# EAGLE design Coco2Composite (EAGLE 9.6.2)
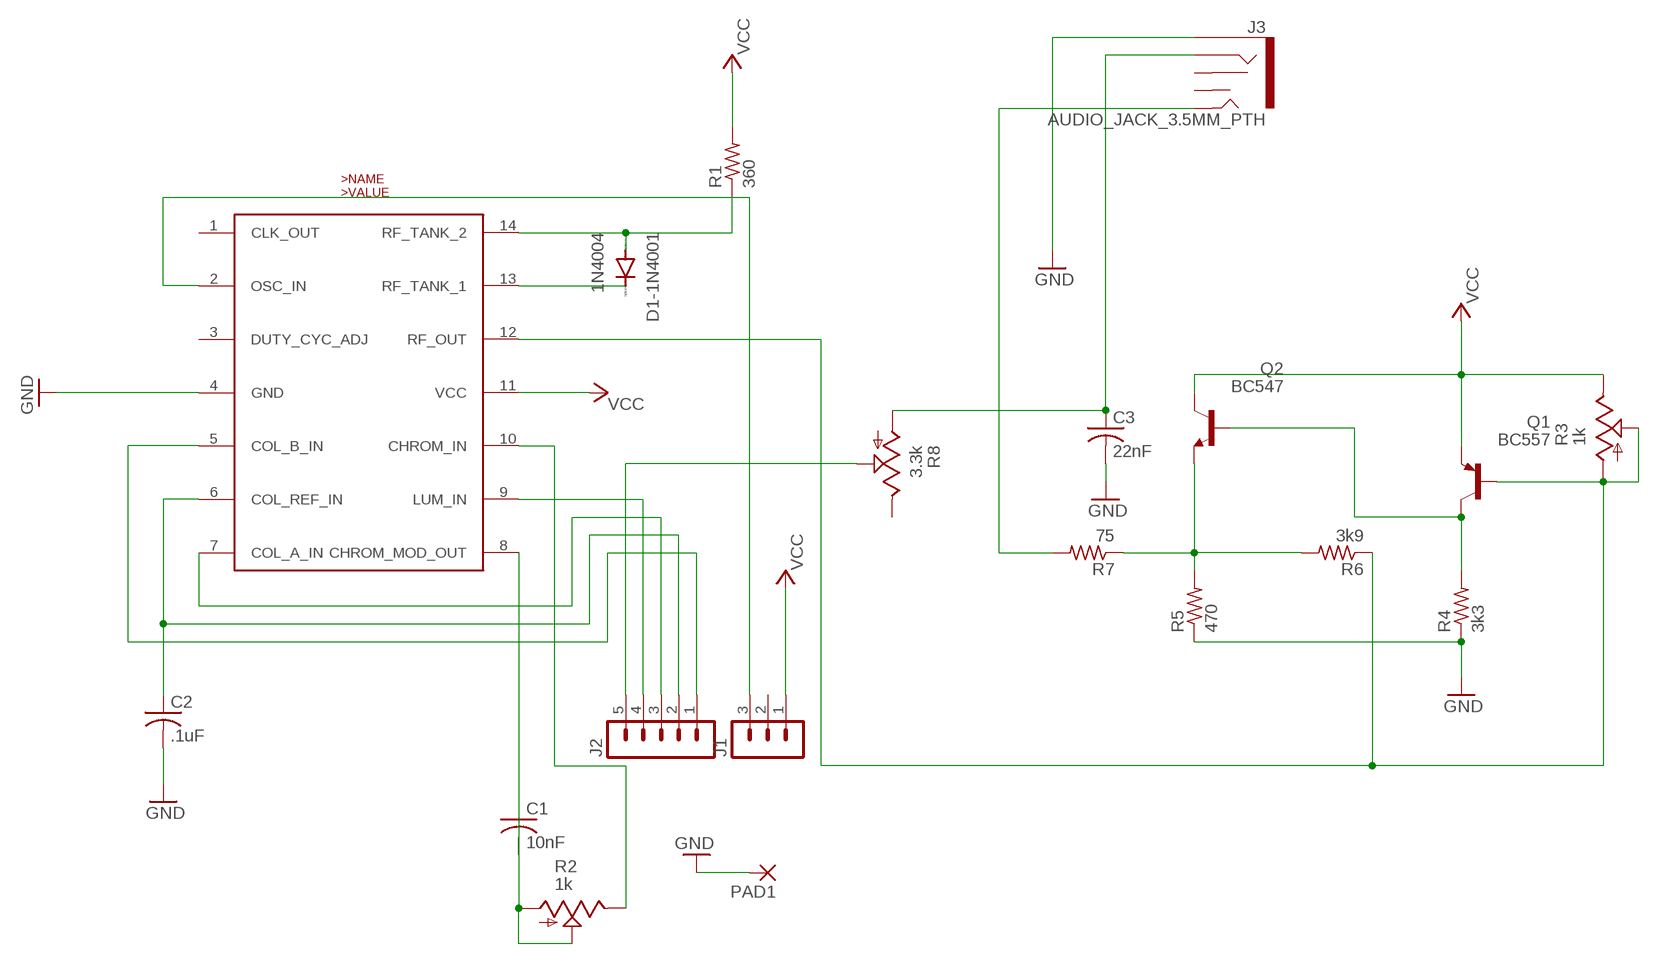
[diagram p0: schematic, sheet 1]

## Parts
C1  10nF  C-US025-024X044  [C025-024X044]
C2  .1uF  C-US025-024X044  [C025-024X044]
C3  22nF  C-US025-024X044  [C025-024X044]
D1-1N4001  1N4004  [DO41-10]
J1  MA03-1  [MA03-1]
J2  MA05-1  [MA05-1]
J3  AUDIO_JACK_3.5MM_PTH  [AUDIO-JACK]
PAD1  2,54/0,8  [2,54/0,8]
Q1  BC557  [TO92-EBC]
Q2  BC547  [TO92]
R1  360  R-US_0204/2V  [0204V]
R2  1k  TRIM_US-B25U  [B25U]
R3  1k  TRIM_US-B25U  [B25U]
R4  3k3  R-US_0204/2V  [0204V]
R5  470  R-US_0204/2V  [0204V]
R6  3k9  R-US_0204/2V  [0204V]
R7  75  R-US_0204/2V  [0204V]
R8  3.3k  TRIM_US-B25U  [B25U]
U1  MC1372  [DIP14]

## Nets
CHB: C2.1 J2.2 U1.6(COL_REF_IN)
CLK: J1.3 U1.2(OSC_IN)
GND: C2.2 C3.2 J3.SLEEVE PAD1.1(P) R4.1 R5.1 U1.4(GND)
N$1: D1-1N4001.C U1.13(RF_TANK_1)
N$2: D1-1N4001.A R1.1 U1.14(RF_TANK_2)
N$3: C1.2 U1.8(CHROM_MOD_OUT)
N$4: C1.1 R2.A R2.S
N$5: R2.E U1.10(CHROM_IN)
N$6: Q1.B R3.A R3.S R6.1 U1.12(RF_OUT)
N$7: Q1.C Q2.2(B) R4.2
N$8: Q2.1(E) R5.2 R6.2 R7.1
N$9: J3.TIP R7.2
N$10: C3.1 J3.RING R8.A
PHI_A: J2.3 U1.7(COL_A_IN)
PHIB: J2.1 U1.5(COL_B_IN)
SND: J2.5 R8.S
VCC: J1.1 Q1.E Q2.3(C) R1.2 R3.E U1.11(VCC)
Y: J2.4 U1.9(LUM_IN)
Unconnected: J1.2 J3.RSH J3.TSH R8.E U1.1(CLK_OUT) U1.3(DUTY_CYC_ADJ)

## Library data of the parts
C1-C3 = resistor:C-US: CAPACITOR, American symbol
D1-1N4001 = diode:1N4004: DIODE general purpose rectifier, 1 A
J1 = con-lstb:MA03-1: PIN HEADER; OC_FARNELL: unknown; OC_NEWARK: unknown
J2 = con-lstb:MA05-1: PIN HEADER; OC_FARNELL: unknown; OC_NEWARK: unknown
J3 = SparkFun-Connectors:AUDIO_JACK_3.5MM: Audio Jack 3.5mm variants of PTH and SMT stereo audio jack with bypass switches. SparkFun Products: SparkFun SparkPunk Sound Kit <[https://www.sparkfun.com/products/11177]> - PTH MP3 Trigger <https://www.sparkfun.com/products/13720> -3.5mm SMD SparkFun PicoBoard <https://www.sparkfun.com/products/11888>- 2.5mm SMD; PROD_ID: CONN-08774; SF_ID: PRT-08032
PAD1 = wirepad:2,54/0,8: THROUGH-HOLE PAD
Q1 = transistor-pnp:BC557*: PNP Transistror
Q2 = transistor-npn:BC547*: NPN Transistor
R1 R4-R7 = resistor:R-US_: RESISTOR, American symbol
R2 R3 R8 = pot:TRIM_US-: POTENTIOMETER
U1 = COCO2Library:MC1372: MC1372

## Board
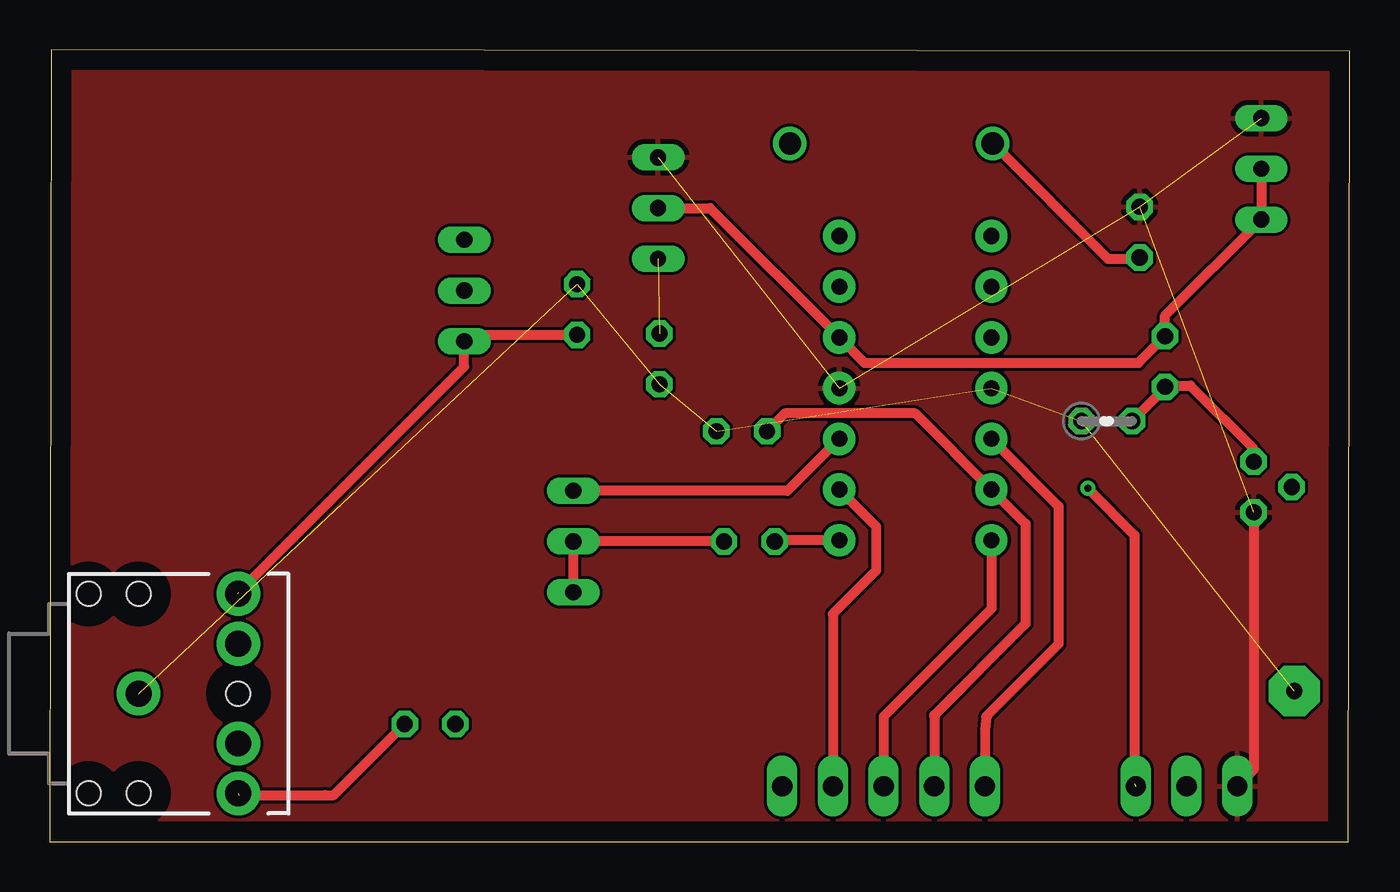
[diagram p1: board, top side]
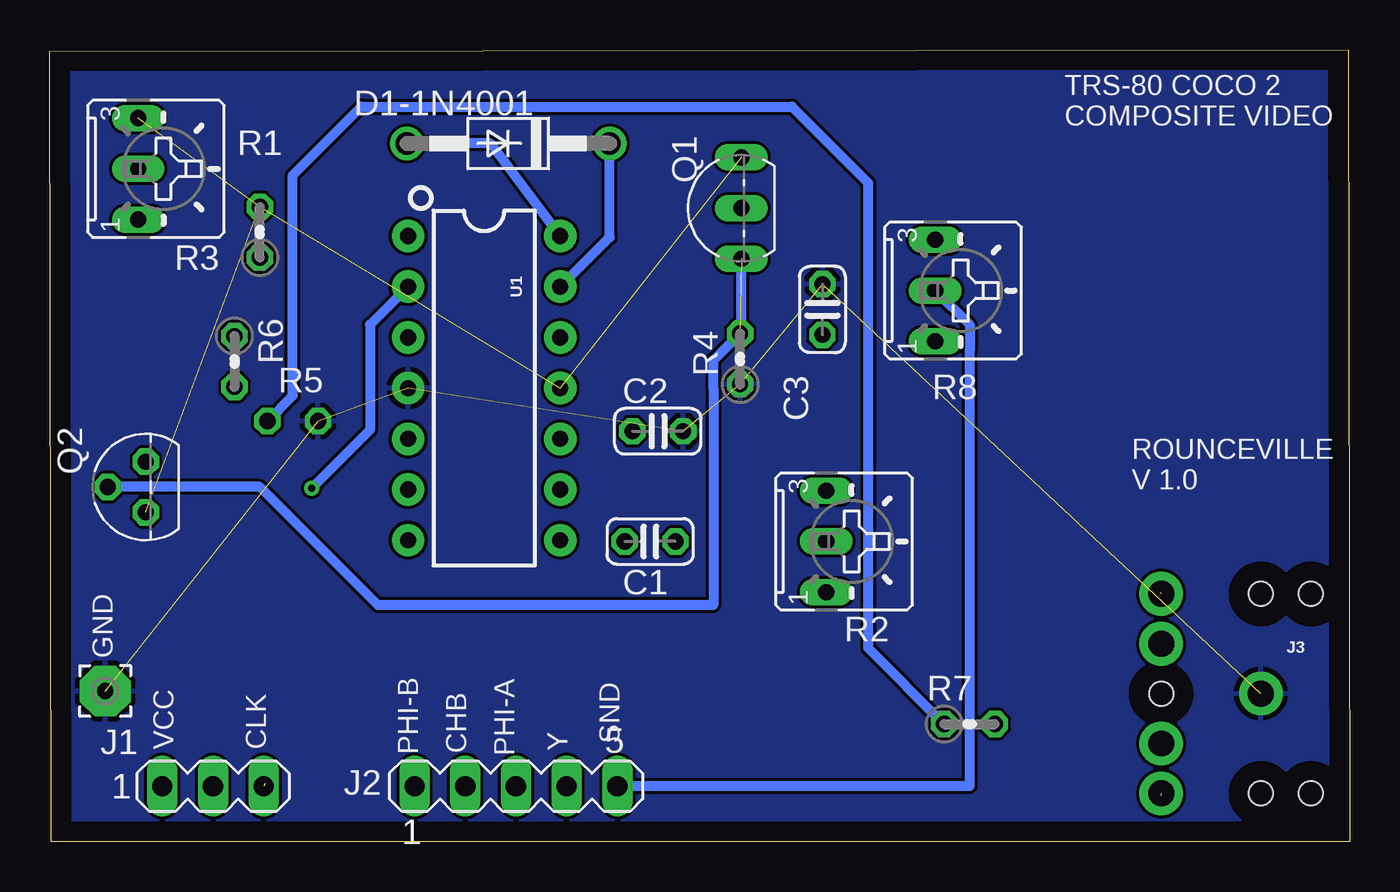
[diagram p2: board, bottom side, seen from below]

Size 65.13 x 39.67 mm. Coordinates in mm from the lower left corner, seen from the top.
Outline: 0,0 65.07,0 65.13,39.61 0.06,39.67 0,0
Copper layers (1*16): Top 0.035mm / dielectric 1.5mm / Bottom 0.035mm
Design rules "default": minimum track width 6mil, minimum drill 0.35mm, track to track 6mil, track to pad 6mil, pad to pad 6mil, via to via 6mil, smd to smd 6mil, copper to edge 40mil, drill to drill 6mil, minimum pad ring 10mil, minimum via ring 8mil, stop-mask expansion 4mil, vias tented up to drill 0mil, thermal gap 10mil

### Footprints (pad centres in the part's own frame; a part is rotated, then mirrored left to right if it is on the bottom)
C025-024X044 = drill 0.813 octagon: 1 -1.27,0; 2 1.27,0
DO41-10 = drill 1.118: A 5.08,0; C -5.08,0
MA03-1 = drill 1.016 long: 1 -2.54,0; 2 0,0; 3 2.54,0
MA05-1 = drill 1.016 long: 1 -5.08,0; 2 -2.54,0; 3 0,0; 4 2.54,0; 5 5.08,0
AUDIO-JACK = drill 1.3 pad 2.184: RING 5,5; RSH 5,2.5; SLEEVE 0,0; TIP 5,-5; TSH 5,-2.5 | hole 1.2: 0,5; -2.5,5; -2.5,-5; 0,-5; 5,0
2,54/0,8 = drill 0.813 pad 2.54 octagon: 1 0,0
TO92-EBC = drill 0.813 long: B 0,-1.27; C -2.54,-1.27; E 2.54,-1.27
TO92 = drill 0.813 octagon: 1 1.27,0; 2 0,1.905; 3 -1.27,0
0204V = drill 0.813 octagon: 1 -1.27,0; 2 1.27,0
B25U = drill 0.813 long: A 2.54,-0.889; E -2.54,-0.889; S 0,-0.889
DIP14 = drill 0.813 pad 1.626: 1 -7.62,-3.81; 2 -5.08,-3.81; 3 -2.54,-3.81; 4 0,-3.81; 5 2.54,-3.81; 6 5.08,-3.81; 7 7.62,-3.81; 8 7.62,3.81; 9 5.08,3.81; 10 2.54,3.81; 11 0,3.81; 12 -2.54,3.81; 13 -5.08,3.81; 14 -7.62,3.81

### Placement (x,y rotation side)
C1  35.05,15.05 180 bottom
C2  34.67,20.57 0 bottom
C3  26.42,26.67 90 bottom
D1-1N4001  42.16,34.99 180 bottom
J1  56.96,2.79 0 bottom
J2  41.78,2.79 0 bottom
J3  4.45,7.43 0 top
PAD1  62.36,7.56 0 bottom
Q1  31.75,31.75 90 bottom
Q2  60.33,17.78 90 bottom
R1  54.61,30.54 90 bottom
R2  25.34,15.05 270 bottom
R3  59.82,33.72 270 bottom
R4  30.54,24.19 90 bottom
R5  52.96,21.08 0 top
R6  55.88,24.07 270 bottom
R7  19.05,5.91 0 bottom
R8  19.88,27.62 270 bottom
U1  43.37,22.73 270 bottom

### Tracks (layer width: path | path; a pad name or v marks a point on that pad's centre or on a via)
CHB
  Top 0.503: C2.1 36.83,21.46 43.37,21.46 U1.6 48.9,15.94 48.9,10.92 44.32,6.35 44.32,6.3 J2.2
CLK  (via drill 0.35)  (1 unrouted)
  Top 0.503: v52.01,17.72 54.36,15.37 54.36,2.92
  Bottom 0.503: U1.2 49.09,25.91 49.09,20.64 v52.01,17.72
GND  (6 unrouted)
  pour Bottom: 0.06,0 67.31,0 67.31,41.91 0.06,41.91
N$1
  Bottom 0.508: U1.13 37.08,30.29 D1-1N4001.C
N$2
  Top 0.152: 54.55,29.21 R1.1
  Top 0.503: D1-1N4001.A 53.02,29.21 54.55,29.21
  Bottom 0.508: U1.14 43.05,34.99 D1-1N4001.A
N$3
  Top 0.503: U1.8 36.65,15.11 C1.2
N$4
  Top 0.503: R2.A R2.S C1.1
N$5
  Top 0.503: U1.10 36.96,17.59 R2.E
N$6
  Top 0.152: 54.48,24 54.55,24
  Top 0.503: 54.55,24 R6.1 55.88,26.35 R3.A R3.S | Q1.B 33.08,31.75
  Top 0.508: 33.08,31.75 U1.12 40.83,24 54.48,24
N$7  (1 unrouted)
  Bottom 0.503: 54.61,17.78 Q2.2 | Q1.C 30.48,25.53 31.88,24.13 31.88,22.73
  Bottom 0.508: 54.61,17.78 48.7,11.87 31.88,11.87 31.88,22.73
N$8
  Top 0.152: R6.2 55.82,22.8 55.88,22.86
  Top 0.503: R6.2 55.88,22.73 R5.2 | 55.88,22.86 57.15,22.86 60.33,19.68 Q2.1
  Bottom 0.503: 24.13,10.16 24.13,9.72 R7.1
  Bottom 0.508: R5.2 52.96,22.35 52.96,33.4 49.53,36.83 27.94,36.83 24.13,33.02 24.13,10.16
N$9  (1 unrouted)
  Top 0.503: 13.78,2.35 14.22,2.35 R7.2
  Top 0.508: 9.46,2.35 13.78,2.35
N$10  (1 unrouted)
  Top 0.503: 20.7,23.75 20.77,23.81 R8.A 21.08,25.4 C3.1
  Top 0.508: 9.46,12.51 20.7,23.75
PHI_A
  Top 0.503: U1.7 47.18,11.68 41.78,6.29 41.78,2.84 J2.3
PHIB
  Top 0.503: U1.5 50.55,16.83 50.55,9.91 46.93,6.29 46.86,5.62 J2.1
SND
  Bottom 0.503: 19.05,2.79 19.05,24.63 19.04,24.64 19.04,25.9 R8.S
  Bottom 0.508: 19.05,2.79 J2.5
VCC  (4 unrouted)
  Top 0.503: Q2.3 60.33,3.62 J1.1
  pour Top: 0,0 67.31,0 67.31,41.91 0,41.91
Y
  Top 0.503: U1.9 41.4,15.81 41.4,13.59 39.24,11.43 J2.4

### Text on the board
bNames: TRS-80 COCO 2 / COMPOSITE VIDEO | ROUNCEVILLE / V 1.0 | GND | SND | Y | CLK | VCC | PHI-A | CHB | PHI-B